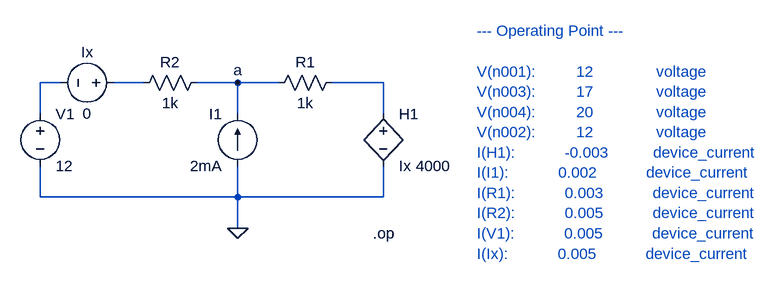
[diagram p0: schematic Q3LT.asc]
Q3LT.asc, the LTspice schematic file:
Version 4
SHEET 1 1048 680
WIRE -64 80 -96 80
WIRE 64 80 16 80
WIRE 208 80 144 80
WIRE 272 80 208 80
WIRE 432 80 352 80
WIRE -96 128 -96 80
WIRE 208 128 208 80
WIRE 432 128 432 80
WIRE -96 256 -96 208
WIRE 208 256 208 208
WIRE 208 256 -96 256
WIRE 432 256 432 208
WIRE 432 256 208 256
WIRE 208 304 208 256
FLAG 208 304 0
FLAG 208 80 a
SYMBOL voltage -96 112 R0
SYMATTR InstName V1
SYMATTR Value 12
SYMBOL current 208 208 R180
WINDOW 0 24 80 Left 2
WINDOW 3 24 0 Left 2
SYMATTR InstName I1
SYMATTR Value 2mA
SYMBOL res 368 64 R90
WINDOW 0 0 56 VBottom 2
WINDOW 3 32 56 VTop 2
SYMATTR InstName R1
SYMATTR Value 1k
SYMBOL res 160 64 R90
WINDOW 0 0 56 VBottom 2
WINDOW 3 32 56 VTop 2
SYMATTR InstName R2
SYMATTR Value 1k
SYMBOL voltage 32 80 R90
WINDOW 0 -32 56 VBottom 2
WINDOW 3 32 56 VTop 2
SYMATTR InstName Ix
SYMATTR Value 0
SYMBOL h 432 112 R0
SYMATTR InstName H1
SYMATTR Value Ix 4000
TEXT 416 312 Left 2 !.op
TEXT 576 0 Left 2 ;--- Operating Point ---\n \nV(n001):         12              voltage\nV(n003):         17              voltage\nV(n004):         20              voltage\nV(n002):         12              voltage\nI(H1):           -0.003          device_current\nI(I1):           0.002           device_current\nI(R1):           0.003           device_current\nI(R2):           0.005           device_current\nI(V1):           0.005           device_current\nI(Ix):           0.005           device_current

The netlist it stands for:
* Q3LT.asc
V1 N001 0 12
I1 0 a 2mA
R1 N003 a 1k
R2 a N002 1k
V§Ix N002 N001 0
H1 N003 0 Ix 4000
.op
* --- Operating Point ---
* V(n001):         12              voltage
* V(n003):         17              voltage
* V(n004):         20              voltage
* V(n002):         12              voltage
* I(H1):           -0.003          device_current
* I(I1):           0.002           device_current
* I(R1):           0.003           device_current
* I(R2):           0.005           device_current
* I(V1):           0.005           device_current
* I(Ix):           0.005           device_current
.backanno
.end